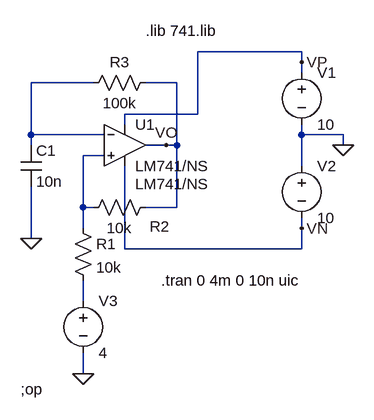
[diagram p0: schematic eje3-p2.asc]
eje3-p2.asc, the LTspice schematic file:
Version 4
SHEET 1 880 680
WIRE 464 32 304 32
WIRE 464 48 464 32
WIRE 464 64 464 48
WIRE 144 80 48 80
WIRE 272 80 224 80
WIRE 304 128 304 32
WIRE 304 128 192 128
WIRE 192 144 192 128
WIRE 48 160 48 80
WIRE 160 160 48 160
WIRE 464 160 464 144
WIRE 528 160 464 160
WIRE 48 176 48 160
WIRE 256 176 224 176
WIRE 272 176 272 80
WIRE 272 176 256 176
WIRE 528 176 528 160
WIRE 160 192 128 192
WIRE 464 208 464 160
WIRE 128 272 128 192
WIRE 144 272 128 272
WIRE 272 272 272 176
WIRE 272 272 224 272
WIRE 128 304 128 272
WIRE 464 304 464 288
WIRE 48 320 48 240
WIRE 192 336 192 208
WIRE 464 336 464 304
WIRE 464 336 192 336
WIRE 128 416 128 384
WIRE 128 528 128 496
FLAG 48 320 0
FLAG 464 48 VP
FLAG 464 304 VN
FLAG 528 176 0
FLAG 256 176 VO
FLAG 128 528 0
SYMBOL res 112 288 R0
SYMATTR InstName R1
SYMATTR Value 10k
SYMBOL res 240 256 R90
WINDOW 0 61 -6 VBottom 2
WINDOW 3 32 56 VTop 2
SYMATTR InstName R2
SYMATTR Value 10k
SYMBOL res 240 64 R90
WINDOW 0 0 56 VBottom 2
WINDOW 3 32 56 VTop 2
SYMATTR InstName R3
SYMATTR Value 100k
SYMBOL cap 32 176 R0
SYMATTR InstName C1
SYMATTR Value 10n
SYMBOL voltage 464 48 R0
WINDOW 123 0 0 Left 0
WINDOW 39 0 0 Left 0
SYMATTR InstName V1
SYMATTR Value 10
SYMBOL voltage 464 192 R0
WINDOW 123 0 0 Left 0
WINDOW 39 0 0 Left 0
SYMATTR InstName V2
SYMATTR Value 10
SYMBOL voltage 128 400 R0
WINDOW 123 0 0 Left 0
WINDOW 39 0 0 Left 0
SYMATTR InstName V3
SYMATTR Value 4
SYMBOL OpAmps\\opamp2 192 112 R0
WINDOW 38 16 124 Left 2
SYMATTR SpiceModel LM741/NS
SYMATTR InstName U1
SYMATTR Value LM741/NS
TEXT 32 552 Left 2 !;op
TEXT 248 384 Left 2 !.tran 0 4m 0 10n uic
TEXT 224 0 Left 2 !.lib 741.lib

The netlist it stands for:
* eje3-p2.asc
R1 N002 N003 10k
R2 VO N002 10k
R3 VO N001 100k
C1 N001 0 10n
V1 VP 0 10
V2 0 VN 10
V3 N003 0 4
XU1 N002 N001 VP VN VO LM741/NS LM741/NS  ; pins In+ In- V+ V- OUT
;op
.tran 0 4m 0 10n uic
.lib 741.lib
.backanno
.end